# EAGLE design smd_missing_pulse_detector_pzt (EAGLE 9.6.2)
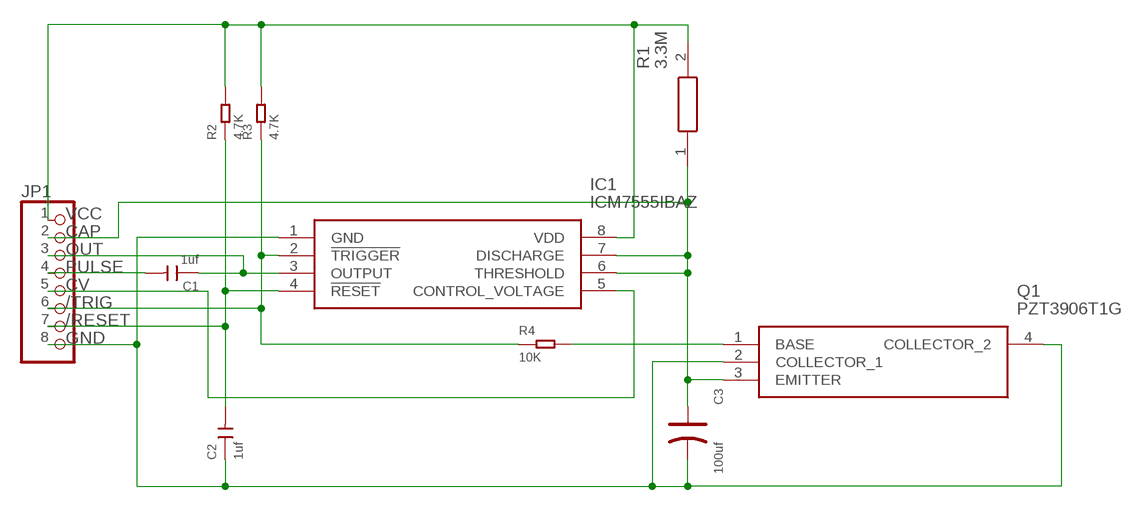
[diagram p0: schematic, sheet 1]

## Parts
C1  1uf  CERAMIC-1UF-25V-10%-X7R(0805)  [C0805]
C2  1uf  CERAMIC-1UF-25V-10%-X7R(0805)  [C0805]
C3  100uf  TANTALUM-SMD-100UF-10V(AVX-B)  [AVX-B]
IC1  ICM7555IBAZ  [SOIC127P600X175-8N]
JP1  PINHD-1X8  [1X08]
Q1  PZT3906T1G  [SOT230P700X175-4N]
R1  3.3M  CRCW06033M30FKEA  [RESC1608X50N]
R2  4.7K  SMD-RES-4.7K-5%-1/10W(0603)  [R0603]
R3  4.7K  SMD-RES-4.7K-5%-1/10W(0603)  [R0603]
R4  10K  SMD-RES-10K-1%-1/10W(0603)  [R0603]

## Nets
/RESET: C2.2 IC1.4(!RESET) JP1.7 R2.1
/TRIG: IC1.2(!TRIGGER) JP1.6 R3.1 R4.1
CAP: C3.+ IC1.6(THRESHOLD) IC1.7(DISCHARGE) JP1.2 Q1.3(EMITTER) R1.1
CV: IC1.5(CONTROL_VOLTAGE) JP1.5
GND: C2.1 C3.- IC1.1(GND) JP1.8 Q1.2(COLLECTOR_1) Q1.4(COLLECTOR_2)
N$1: Q1.1(BASE) R4.2
OUT: C1.1 IC1.3(OUTPUT) JP1.3
PULSE: C1.2 JP1.4
VCC: IC1.8(VDD) JP1.1 R1.2 R2.2 R3.2

## Library data of the parts
C1 C2 = OPL_Capacitor:CERAMIC-1UF-25V-10%-X7R(0805): 302010179; MPN: CC0805KKX7R8BB105
C3 = OPL_Capacitor:TANTALUM-SMD-100UF-10V(AVX-B): 302020015; MPN: TAJB107M010#NJ
IC1 = ICM7555IBAZ:ICM7555IBAZ: ICM7555IBAZ, General Purpose Timer 1MHz, 2 to 18V, 8-Pin SOIC-8 Source: Datasheet <https://datasheet.datasheetarchive.com/originals/distributors/SFDatasheet-6/sf-000136291.pdf>; ARROW_PART_NUMBER: ICM7555IBAZ; ARROW_PRICE-STOCK: https://www.arrow.com/en/products/icm7555ibaz/intersil; DESCRIPTION: ICM7555IBAZ, General Purpose Timer 1MHz, 2 to 18V, 8-Pin SOIC-8; HEIGHT: 1.75mm; MANUFACTURER_NAME: Intersil; MANUFACTURER_PART_NUMBER: ICM7555IBAZ; MOUSER_PART_NUMBER: 968-ICM7555IBAZ; MOUSER_PRICE-STOCK: https://www.mouser.com/Search/ProductDetail.aspx?qs=9fLuogzTs8Jv0Cw4QvRWRA%3d%3d
JP1 = Connector:PINHD-1X8: PIN HEADER; CATEGORY: CONNECTOR; SUB-CATEGORY: PIN-HEADER
Q1 = PZT3906T1G:PZT3906T1G: 200 mA 40 V PNP Bipolar Juncitin Transistor package in SOT-223 Source: Datasheet <https://www.onsemi.com/pdf/datasheet/pzt3906t1-d.pdf>; DESCRIPTION: 200 mA 40 V PNP Bipolar Juncitin Transistor package in SOT-223; HEIGHT: 1.75mm; MANUFACTURER_NAME: onsemi; MANUFACTURER_PART_NUMBER: PZT3906T1G
R1 = CRCW06033M30FKEA:CRCW06033M30FKEA: CRCW0603 Resistor T/R 0.10W,1%,3M3 Vishay CRCW Series Thick Film Surface Mount Resistor 0603 Case 3.3M +/-1% 0.1W +/-100ppm/C Source: Datasheet <http://www.vishay.com/docs/20035/dcrcwe3.pdf>; ARROW_PART_NUMBER: CRCW06033M30FKEA; ARROW_PRICE-STOCK: https://www.arrow.com/en/products/crcw06033m30fkea/vishay; DESCRIPTION: CRCW0603 Resistor T/R 0.10W,1%,3M3 Vishay CRCW Series Thick Film Surface Mount Resistor 0603 Case 3.3M +/-1% 0.1W +/-100ppm/C; HEIGHT: 0.5mm; MANUFACTURER_NAME: Vishay; MANUFACTURER_PART_NUMBER: CRCW06033M30FKEA; MOUSER_PART_NUMBER: 71-CRCW06033M30FKEA; MOUSER_PRICE-STOCK: https://www.mouser.co.uk/ProductDetail/Vishay-Dale/CRCW06033M30FKEA?qs=xDiHhyYQ5oswxJh74ZTuZg%3D%3D
R2 R3 = OPL_Resistor:SMD-RES-4.7K-5%-1/10W(0603): 301010290; MPN: RC0603JR-074K7L
R4 = OPL_Resistor:SMD-RES-10K-1%-1/10W(0603): 301011970; MPN: RC0603FR-0710KL

## Board
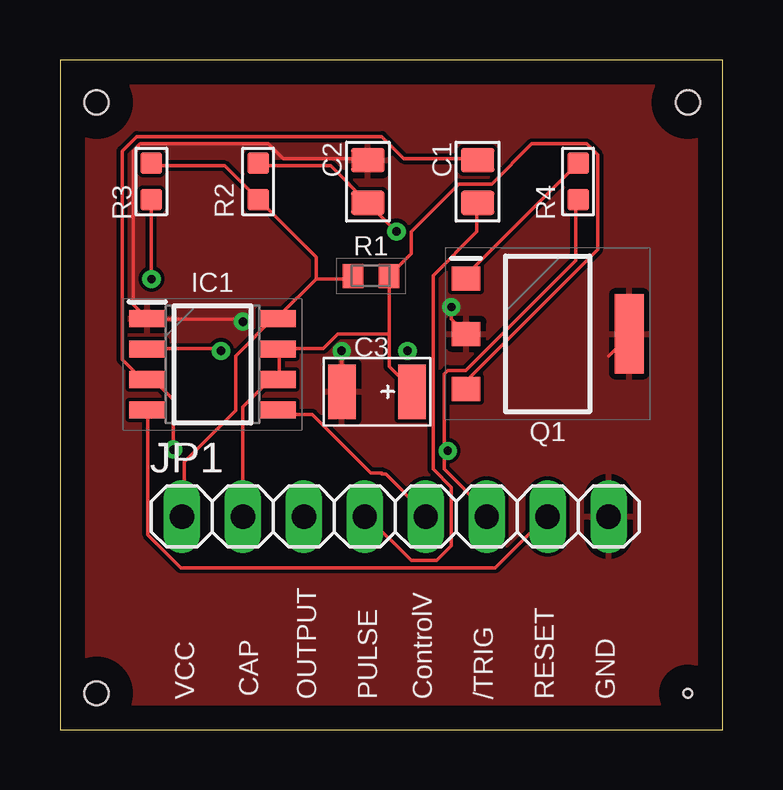
[diagram p1: board, top side]
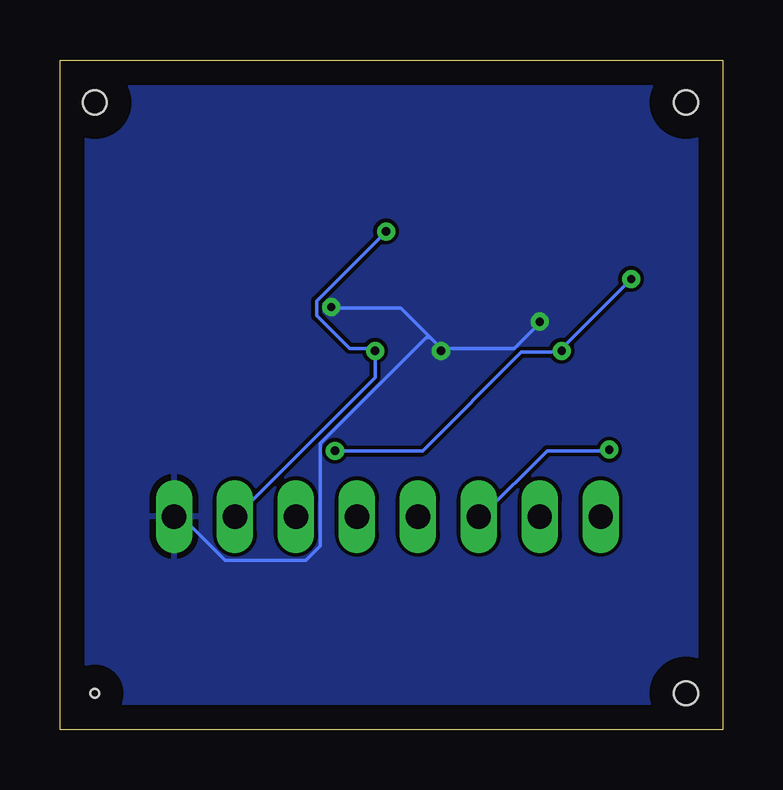
[diagram p2: board, bottom side, seen from below]

Size 27.61 x 27.93 mm. Coordinates in mm from the lower left corner, seen from the top.
Outline: 0,0 27.61,0 27.61,27.93 0,27.93 0,0
Copper layers (1*16): Top 0.035mm / dielectric 1.5mm / Bottom 0.035mm
Design rules "default": minimum track width 6mil, minimum drill 0.35mm, track to track 6mil, track to pad 6mil, pad to pad 6mil, via to via 6mil, smd to smd 6mil, copper to edge 40mil, drill to drill 6mil, minimum pad ring 10mil, minimum via ring 8mil, stop-mask expansion 4mil, vias tented up to drill 0mil, thermal gap 10mil
Holes 1 mm at 1.52,26.16 26.16,26.16 1.52,1.52
Holes 0.35 mm at 26.16,1.52

### Footprints (pad centres in the part's own frame; a part is rotated, then mirrored left to right if it is on the bottom)
C0805 = smd 1.397 x 1.016: 1 0,0.889; 2 0,-0.889
AVX-B = smd 1.143 x 2.286: + -1.46,0; - 1.46,0
SOIC127P600X175-8N = smd 1.525 x 0.7: 1 -2.712,1.905; 2 -2.712,0.635; 3 -2.712,-0.635; 4 -2.712,-1.905; 5 2.712,-1.905; 6 2.712,-0.635; 7 2.712,0.635; 8 2.712,1.905
1X08 = drill 1.016 long: 1 -8.89,0; 2 -6.35,0; 3 -3.81,0; 4 -1.27,0; 5 1.27,0; 6 3.81,0; 7 6.35,0; 8 8.89,0
SOT230P700X175-4N = smd 1.2 x 1: 1 -3.4,2.3; 2 -3.4,0; 3 -3.4,-2.3 | smd 1.2 x 3.3: 4 3.4,0
RESC1608X50N = smd 0.85 x 1: 1 -0.75,0; 2 0.75,0
R0603 = smd 0.889 x 0.889: 1 0,0.762; 2 0,-0.762

### Placement (x,y rotation side)
C1  17.4,22.86 0 top
C2  12.83,22.86 0 top
C3  13.21,14.1 180 top
IC1  6.35,15.24 0 top
JP1  13.97,8.89 0 top
Q1  20.32,16.51 0 top
R1  12.95,18.92 180 top
R2  8.26,22.86 0 top
R3  3.81,22.86 180 top
R4  21.59,22.86 180 top

### Tracks (layer width: path | path; a pad name or v marks a point on that pad's centre or on a via)
/RESET  (via drill 0.35)
  Top 0.152: 8.38,23.57 R2.1 8.38,23.52 11.28,23.52 C2.2 | 12.8,22.05 C2.2 | 3.66,13.21 IC1.4 3.66,13.16 3.66,8.13 5.03,6.76 18.14,6.76 20.24,8.87 | 12.95,21.89 C2.2 | 20.27,8.89 20.24,8.87 | v14.02,20.78 C2.2 | JP1.7 20.27,8.84 20.24,8.87
  Bottom 0.152: v14.02,20.78 16.92,17.88 16.92,17.27 15.54,15.9 14.48,15.9 v14.48,15.8 14.48,14.68 20.27,8.89 20.27,8.84 JP1.7
/TRIG  (via drill 0.35)
  Top 0.152: 3.66,15.8 IC1.2 3.66,15.9 6.71,15.9 v6.71,15.8 | v3.81,18.8 R3.1 | 16,11.63 16,10.87 17.68,9.2 17.68,8.84 JP1.6 | 16,11.63 16,14.83 16.15,14.99 16.92,14.99 21.49,19.56 21.49,22 R4.1 | 16,11.63 v16.15,11.63
  Bottom 0.152: v3.81,18.8 6.71,15.9 v6.71,15.8 6.71,15.75 8.38,15.75 12.5,11.63 v16.15,11.63
CAP
  Top 0.152: 9.14,14.73 IC1.6 | 9.14,15.8 IC1.7 | 13.72,18.85 R1.1 | 14.63,14.12 C3.+ 14.63,14.22 13.72,15.14 13.72,16.51 | 9.14,15.95 IC1.7 | 17.07,14.12 Q1.3 17.07,14.22 17.07,14.68 22.4,20.02 22.4,23.98 21.95,24.43 19.66,24.43 17.98,22.76 16.61,22.76 14.63,20.78 14.63,19.86 13.72,18.95 R1.1 | 8.99,14.58 IC1.6 | IC1.6 9.14,14.68 9.14,15.75 IC1.7 | 13.72,16.51 13.72,18.8 R1.1 | 13.72,16.51 11.58,16.51 10.97,15.9 9.14,15.9 IC1.7 | IC1.6 8.99,14.53 8.69,14.53 7.62,13.46 JP1.2
CV
  Top 0.152: 9.14,13.21 IC1.5 9.14,13.16 10.52,13.16 12.95,10.72 13.41,10.72 13.41,10.67 13.56,10.67 15.24,8.99 JP1.5
GND  (via drill 0.35)
  Top 0.152: 16.92,16.56 Q1.2 16.31,17.12 v16.31,17.63 | 12.95,23.72 C2.1 12.8,23.82 9.3,23.82 8.69,24.43 3.35,24.43 3.05,24.13 3.05,17.73 3.5,17.27 IC1.1 | 3.66,17.02 IC1.1 | 11.73,14.12 C3.- 11.73,14.22 v11.73,15.8 | 23.62,16.41 Q1.4 23.62,16.36 22.86,15.6 | v7.62,17.02 7.62,17.12 3.66,17.12 IC1.1
  Bottom 0.152: 11.73,15.9 8.69,15.9 7.62,16.97 v7.62,17.02 | 11.73,15.9 12.19,16.36 | 12.19,16.36 13.41,17.58 16.31,17.58 v16.31,17.63 | 11.73,15.9 v11.73,15.8 | 22.55,8.89 20.73,7.06 17.37,7.06 16.76,7.67 16.76,11.94 12.34,16.36 12.19,16.36
  pour Top: 27.18,27.43 0.51,27.43 0.51,0.51 0.64,0.38 27.18,0.38
  pour Bottom: 26.8,27.18 0.89,27.18 0.89,0.64 26.67,0.64 26.8,0.76
N$1
  Top 0.152: 17.07,18.85 Q1.1 16.92,18.95 R4.2
OUT  (via drill 0.35)
  Top 0.152: 17.37,23.88 C1.1 17.37,23.82 14.33,23.82 13.41,24.74 3.2,24.74 2.59,24.13 2.59,15.44 3.5,14.53 IC1.3 3.66,14.53 3.96,14.53 4.72,13.77 v4.72,11.68
  Bottom 0.152: v4.72,11.68 4.72,11.63 7.32,11.63 10.06,8.89 10.06,8.84 JP1.3
PULSE
  Top 0.152: 17.37,21.89 C1.2 17.37,21.84 17.37,20.78 15.54,18.95 15.54,10.87 16.31,10.11 16.31,7.67 15.7,7.06 14.63,7.06 12.83,8.87 | 12.8,8.89 12.83,8.87 | JP1.4 12.8,8.84 12.83,8.87
VCC
  Top 0.152: 8.23,22.05 R2.2 | 12.19,18.85 R1.2 12.19,18.8 10.67,18.8 | 9.14,17.17 IC1.8 | 8.38,22.05 R2.2 | 8.99,17.02 IC1.8 | 10.67,18.8 9.14,17.27 IC1.8 | R3.2 3.81,23.52 6.86,23.52 8.23,22.15 R2.2 | 10.67,18.8 10.67,19.71 8.38,22 R2.2 | IC1.8 8.99,17.27 7.32,15.6 7.32,13.31 5.18,11.18 5.18,8.84 JP1.1

### Text on the board
tPlace: VCC | CAP | OUTPUT | PULSE | ControlV | /TRIG | RESET | GND